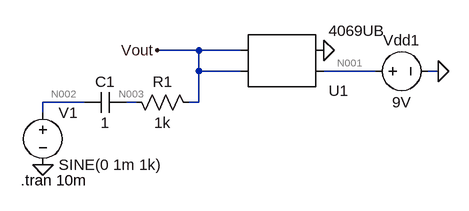
[diagram p0: schematic Draft1.asc]
* Draft1.asc
* U1: 4069UB (symbol AutoGenerated\4069UB not available, pins judged from their places): pin1=Vout pin2=Vout pin3=N001 pin4=0
Vdd1 N001 0 9V
V1 N002 0 SINE(0 1m 1k)
R1 N003 Vout 1k
C1 N003 N002 1
.tran 10m
.backanno
.end

* Results of the author's LTspice run, read from the files saved beside the schematic
* Operating Point, zero values left out:
*   V(vout) = 4.014 V
*   V(n001) = 9 V
*   V(n003) = 4.014 V
*   I(C1) = 4.014 pA
*   I(R1) = -4.014 pA
*   I(V1) = 4.014 pA
*   I(Vdd1) = -2.83 mA
*   Ix(u1:VO) = -4.014 pA
*   Ix(u1:VDD) = 2.83 mA
*   Ix(u1:VSS) = -2.83 mA
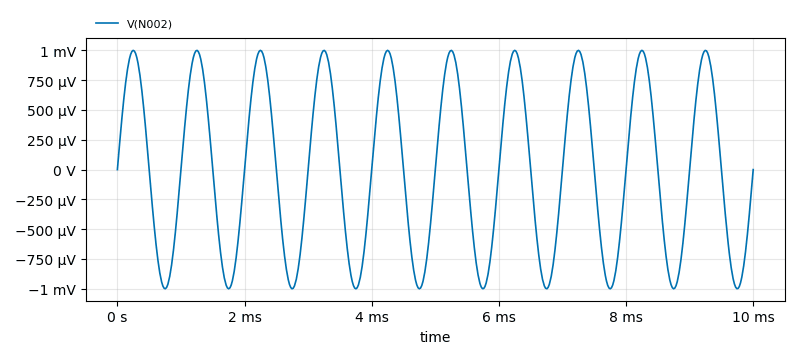
[diagram p1: Transient Analysis of Draft1.asc, plotted from the saved traces]
* Transient Analysis, 1 run:
*   V(N002): min -1 mV, max 1 mV, average 25.98 nV, rms 708.3 µV, last 0 V